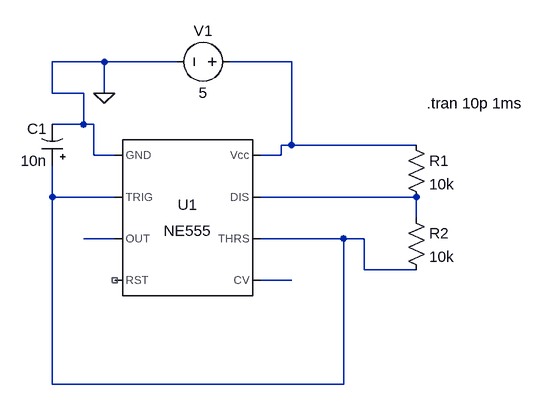
[diagram p0: schematic Draft6.asc]
Draft6.asc, the LTspice schematic file:
Version 4
SHEET 1 956 680
WIRE 272 48 192 48
WIRE 384 48 272 48
WIRE 560 48 464 48
WIRE 192 96 192 48
WIRE 240 96 192 96
WIRE 272 96 272 48
WIRE 240 144 240 96
WIRE 240 144 192 144
WIRE 256 144 240 144
WIRE 560 176 560 48
WIRE 560 176 544 176
WIRE 752 176 560 176
WIRE 256 192 256 144
WIRE 288 192 256 192
WIRE 544 192 544 176
WIRE 544 192 512 192
WIRE 192 256 192 208
WIRE 288 256 192 256
WIRE 752 256 512 256
WIRE 752 288 752 256
WIRE 288 320 240 320
WIRE 640 320 512 320
WIRE 672 320 640 320
WIRE 672 368 672 320
WIRE 752 368 672 368
WIRE 560 384 512 384
WIRE 192 544 192 256
WIRE 640 544 640 320
WIRE 640 544 192 544
FLAG 272 96 0
SYMBOL Misc/NE555 400 288 R0
SYMATTR InstName U1
SYMBOL res 736 160 R0
SYMATTR InstName R1
SYMATTR Value 10k
SYMBOL res 736 272 R0
SYMATTR InstName R2
SYMATTR Value 10k
SYMBOL polcap 208 208 R180
WINDOW 0 24 57 Left 2
WINDOW 3 24 8 Left 2
SYMATTR InstName C1
SYMATTR Value 10n
SYMBOL voltage 480 48 R90
WINDOW 0 -32 56 VBottom 2
WINDOW 3 32 56 VTop 2
SYMATTR InstName V1
SYMATTR Value 5
TEXT 768 112 Left 2 !.tran 10p 1ms

The netlist it stands for:
* Draft6.asc
XU1 0 N002 N004 NC_01 N005 N002 N003 N001 NE555  ; pins GND TRIG OUT RST CV THRS DIS Vcc
R1 N001 N003 10k
R2 N003 N002 10k
C1 N002 0 10n
V1 N001 0 5
.tran 10p 1ms
.lib NE555.sub
.backanno
.end